# EAGLE design Robotics Ring Light (EAGLE 7.5.0)
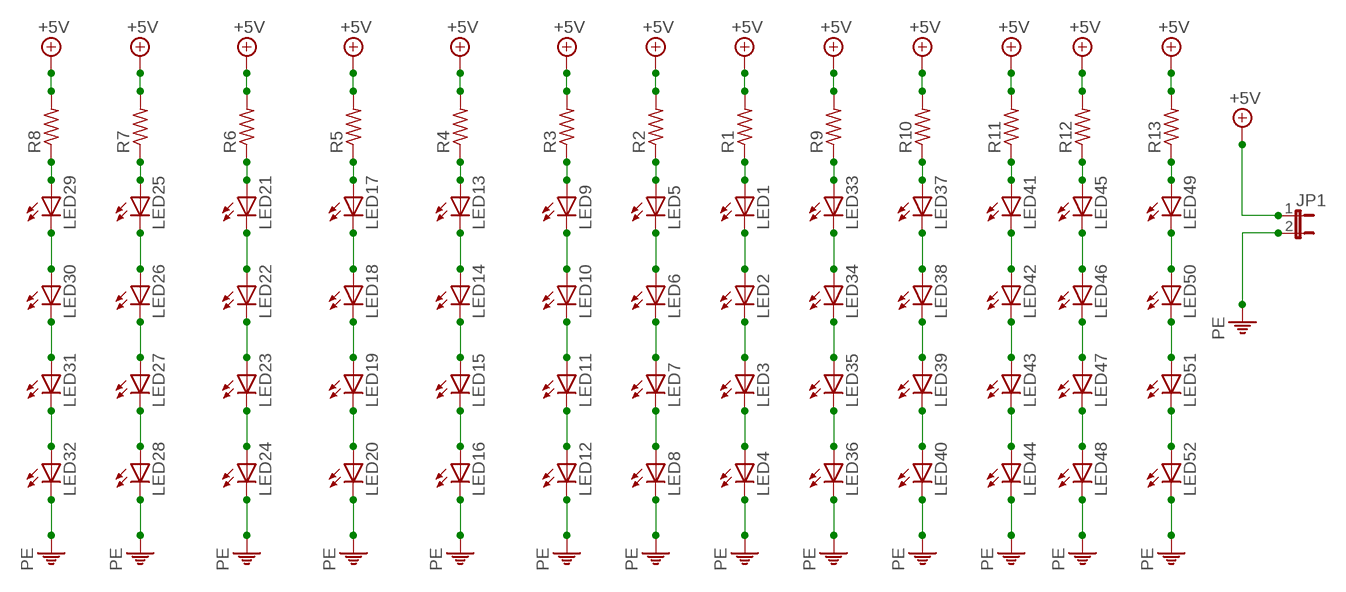
[diagram p0: schematic, sheet 1]

## Parts
JP1  JP1E  [JP1]
LED1  LED5MM  [LED5MM]
LED2  LED5MM  [LED5MM]
LED3  LED5MM  [LED5MM]
LED4  LED5MM  [LED5MM]
LED5  LED5MM  [LED5MM]
LED6  LED5MM  [LED5MM]
LED7  LED5MM  [LED5MM]
LED8  LED5MM  [LED5MM]
LED9  LED5MM  [LED5MM]
LED10  LED5MM  [LED5MM]
LED11  LED5MM  [LED5MM]
LED12  LED5MM  [LED5MM]
LED13  LED5MM  [LED5MM]
LED14  LED5MM  [LED5MM]
LED15  LED5MM  [LED5MM]
LED16  LED5MM  [LED5MM]
LED17  LED5MM  [LED5MM]
LED18  LED5MM  [LED5MM]
LED19  LED5MM  [LED5MM]
LED20  LED5MM  [LED5MM]
LED21  LED5MM  [LED5MM]
LED22  LED5MM  [LED5MM]
LED23  LED5MM  [LED5MM]
LED24  LED5MM  [LED5MM]
LED25  LED5MM  [LED5MM]
LED26  LED5MM  [LED5MM]
LED27  LED5MM  [LED5MM]
LED28  LED5MM  [LED5MM]
LED29  LED5MM  [LED5MM]
LED30  LED5MM  [LED5MM]
LED31  LED5MM  [LED5MM]
LED32  LED5MM  [LED5MM]
LED33  LED5MM  [LED5MM]
LED34  LED5MM  [LED5MM]
LED35  LED5MM  [LED5MM]
LED36  LED5MM  [LED5MM]
LED37  LED5MM  [LED5MM]
LED38  LED5MM  [LED5MM]
LED39  LED5MM  [LED5MM]
LED40  LED5MM  [LED5MM]
LED41  LED5MM  [LED5MM]
LED42  LED5MM  [LED5MM]
LED43  LED5MM  [LED5MM]
LED44  LED5MM  [LED5MM]
LED45  LED5MM  [LED5MM]
LED46  LED5MM  [LED5MM]
LED47  LED5MM  [LED5MM]
LED48  LED5MM  [LED5MM]
LED49  LED5MM  [LED5MM]
LED50  LED5MM  [LED5MM]
LED51  LED5MM  [LED5MM]
LED52  LED5MM  [LED5MM]
R1  R-US_0207/10  [0207/10]
R2  R-US_0207/10  [0207/10]
R3  R-US_0207/10  [0207/10]
R4  R-US_0207/10  [0207/10]
R5  R-US_0207/10  [0207/10]
R6  R-US_0207/10  [0207/10]
R7  R-US_0207/10  [0207/10]
R8  R-US_0207/10  [0207/10]
R9  R-US_0207/10  [0207/10]
R10  R-US_0207/10  [0207/10]
R11  R-US_0207/10  [0207/10]
R12  R-US_0207/10  [0207/10]
R13  R-US_0207/10  [0207/10]

## Nets
+5V: JP1.1 R1.2 R2.2 R3.2 R4.2 R5.2 R6.2 R7.2 R8.2 R9.2 R10.2 R11.2 R12.2 R13.2
N$1: LED1.K(C) LED2.A
N$2: LED2.K(C) LED3.A
N$3: LED3.K(C) LED4.A
N$4: LED5.K(C) LED6.A
N$5: LED1.A R1.1
N$6: LED6.K(C) LED7.A
N$7: LED7.K(C) LED8.A
N$8: LED5.A R2.1
N$9: LED9.K(C) LED10.A
N$10: LED10.K(C) LED11.A
N$11: LED11.K(C) LED12.A
N$12: LED9.A R3.1
N$13: LED13.K(C) LED14.A
N$14: LED14.K(C) LED15.A
N$15: LED15.K(C) LED16.A
N$16: LED13.A R4.1
N$17: LED17.K(C) LED18.A
N$18: LED18.K(C) LED19.A
N$19: LED19.K(C) LED20.A
N$20: LED17.A R5.1
N$21: LED21.K(C) LED22.A
N$22: LED22.K(C) LED23.A
N$23: LED23.K(C) LED24.A
N$24: LED21.A R6.1
N$25: LED25.K(C) LED26.A
N$26: LED26.K(C) LED27.A
N$27: LED27.K(C) LED28.A
N$28: LED25.A R7.1
N$29: LED29.K(C) LED30.A
N$30: LED30.K(C) LED31.A
N$31: LED31.K(C) LED32.A
N$32: LED29.A R8.1
N$33: LED33.K(C) LED34.A
N$34: LED34.K(C) LED35.A
N$35: LED35.K(C) LED36.A
N$36: LED33.A R9.1
N$37: LED37.K(C) LED38.A
N$38: LED38.K(C) LED39.A
N$39: LED39.K(C) LED40.A
N$40: LED37.A R10.1
N$41: LED41.K(C) LED42.A
N$42: LED42.K(C) LED43.A
N$43: LED43.K(C) LED44.A
N$44: LED41.A R11.1
N$45: LED45.K(C) LED46.A
N$46: LED46.K(C) LED47.A
N$47: LED47.K(C) LED48.A
N$48: LED45.A R12.1
N$49: LED49.K(C) LED50.A
N$50: LED50.K(C) LED51.A
N$51: LED51.K(C) LED52.A
N$52: LED49.A R13.1
PE: JP1.2 LED4.K(C) LED8.K(C) LED12.K(C) LED16.K(C) LED20.K(C) LED24.K(C) LED28.K(C) LED32.K(C) LED36.K(C) LED40.K(C) LED44.K(C) LED48.K(C) LED52.K(C)

## Library data of the parts
JP1 = jumper:JP1E: JUMPER
LED1-LED52 = led:LED: LED OSRAM: - CHIPLED LG R971, LG N971, LY N971, LG Q971, LY Q971, LO R971, LY R971 LH N974, LH R974 LS Q976, LO Q976, LY Q976 LO Q996 - Hyper CHIPLED LW Q18S LB Q993, LB Q99A, LB R99A - SideLED LS A670, LO A670, LY A670, LG A670, LP A670 LB A673, LV A673, LT A673, LW A673 LH A674 LY A675 LS A676, LA A676, LO A676, LY A676, LW A676 LS A679, LY A679, LG A679 - Hyper Micro SIDELED® LS Y876, LA Y876, LO Y876, LY Y876 LT Y87S - SmartLED LW L88C, LW L88S LB L89C, LB L89S, LG L890 LS L89K, LO L89K, LY L89K LS L896, LA L896, LO L896, LY L896 - TOPLED LS T670, LO T670, LY T670, LG T670, LP T670 LSG T670, LSP T670, LSY T670, LOP T670, LYG T670 LG T671, LOG T671, LSG T671 LB T673, LV T673, LT T673, LW T673 LH T674 LS T676, LA T676, LO T676, LY T676, LB T676, LH T676, LSB T676, LW T676 LB T67C, LV T67C, LT T67C, LS T67K, LO T67K, LY T67K, LW E67C LS E67B, LA E67B, LO E67B, LY E67B, LB E67C, LV E67C, LT E67C LW T67C LS T679, LY T679, LG T679 LS T770, LO T770, LY T770, LG T770, LP T770 LB T773, LV T773, LT T773, LW T773 LH T774 LS E675, LA E675, LY E675, LS T675 LS T776, LA T776, LO T776, LY T776, LB T776 LHGB T686 LT T68C, LB T68C - Hyper Mini TOPLED® LB M676 - Mini TOPLED Santana® LG M470 LS M47K, LO M47K, LY M47K Source: http://www.osram.convergy.de LUXEON: - LUMILED® LXK2-PW12-R00, LXK2-PW12-S00, LXK2-PW14-U00, LXK2-PW14-V00 LXK2-PM12-R00, LXK2-PM12-S00, LXK2-PM14-U00 LXK2-PE12-Q00, LXK2-PE12-R00, LXK2-PE12-S00, LXK2-PE14-T00, LXK2-PE14-U00 LXK2-PB12-K00, LXK2-PB12-L00, LXK2-PB12-M00, LXK2-PB14-N00, LXK2-PB14-P00, LXK2-PB14-Q00 LXK2-PR12-L00, LXK2-PR12-M00, LXK2-PR14-Q00, LXK2-PR14-R00 LXK2-PD12-Q00, LXK2-PD12-R00, LXK2-PD12-S00 LXK2-PH12-R00, LXK2-PH12-S00 LXK2-PL12-P00, LXK2-PL12-Q00, LXK2-PL12-R00 Source: www.luxeon.com KINGBRIGHT: KA-3528ASYC Source: www.kingbright.com
R1-R13 = resistor:R-US_: RESISTOR, American symbol

## Board
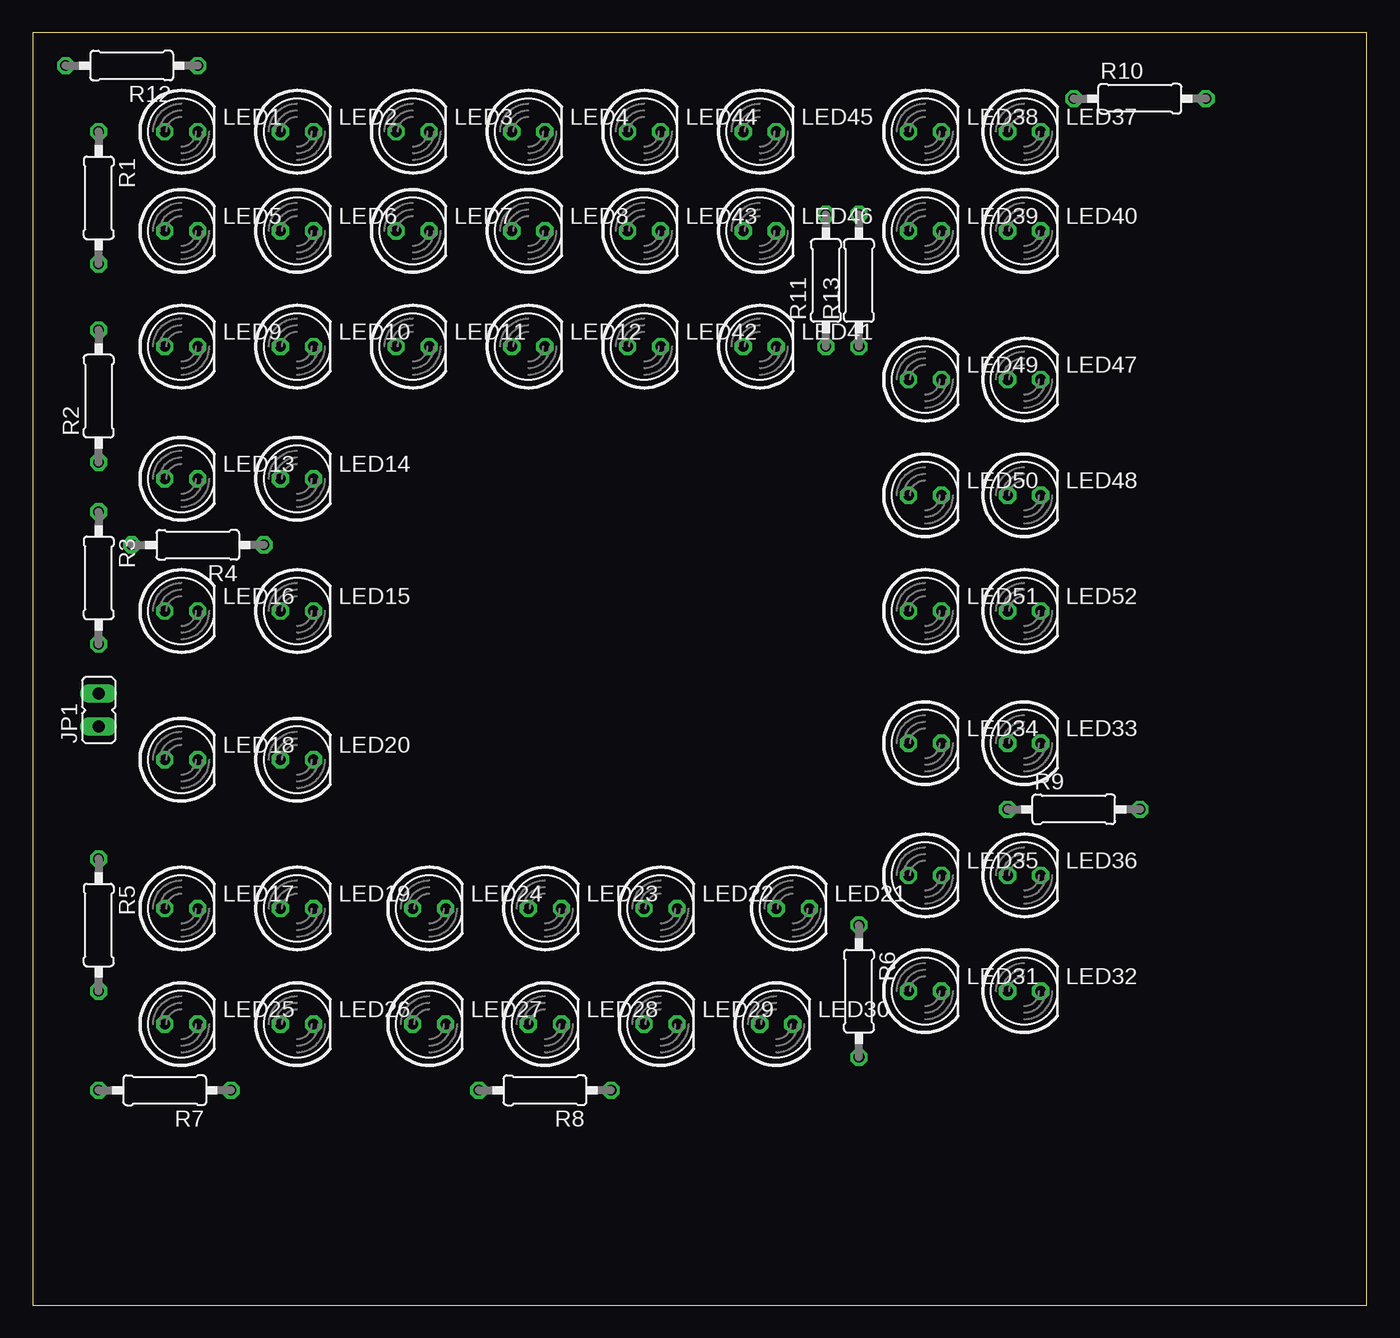
[diagram p1: board, top side]
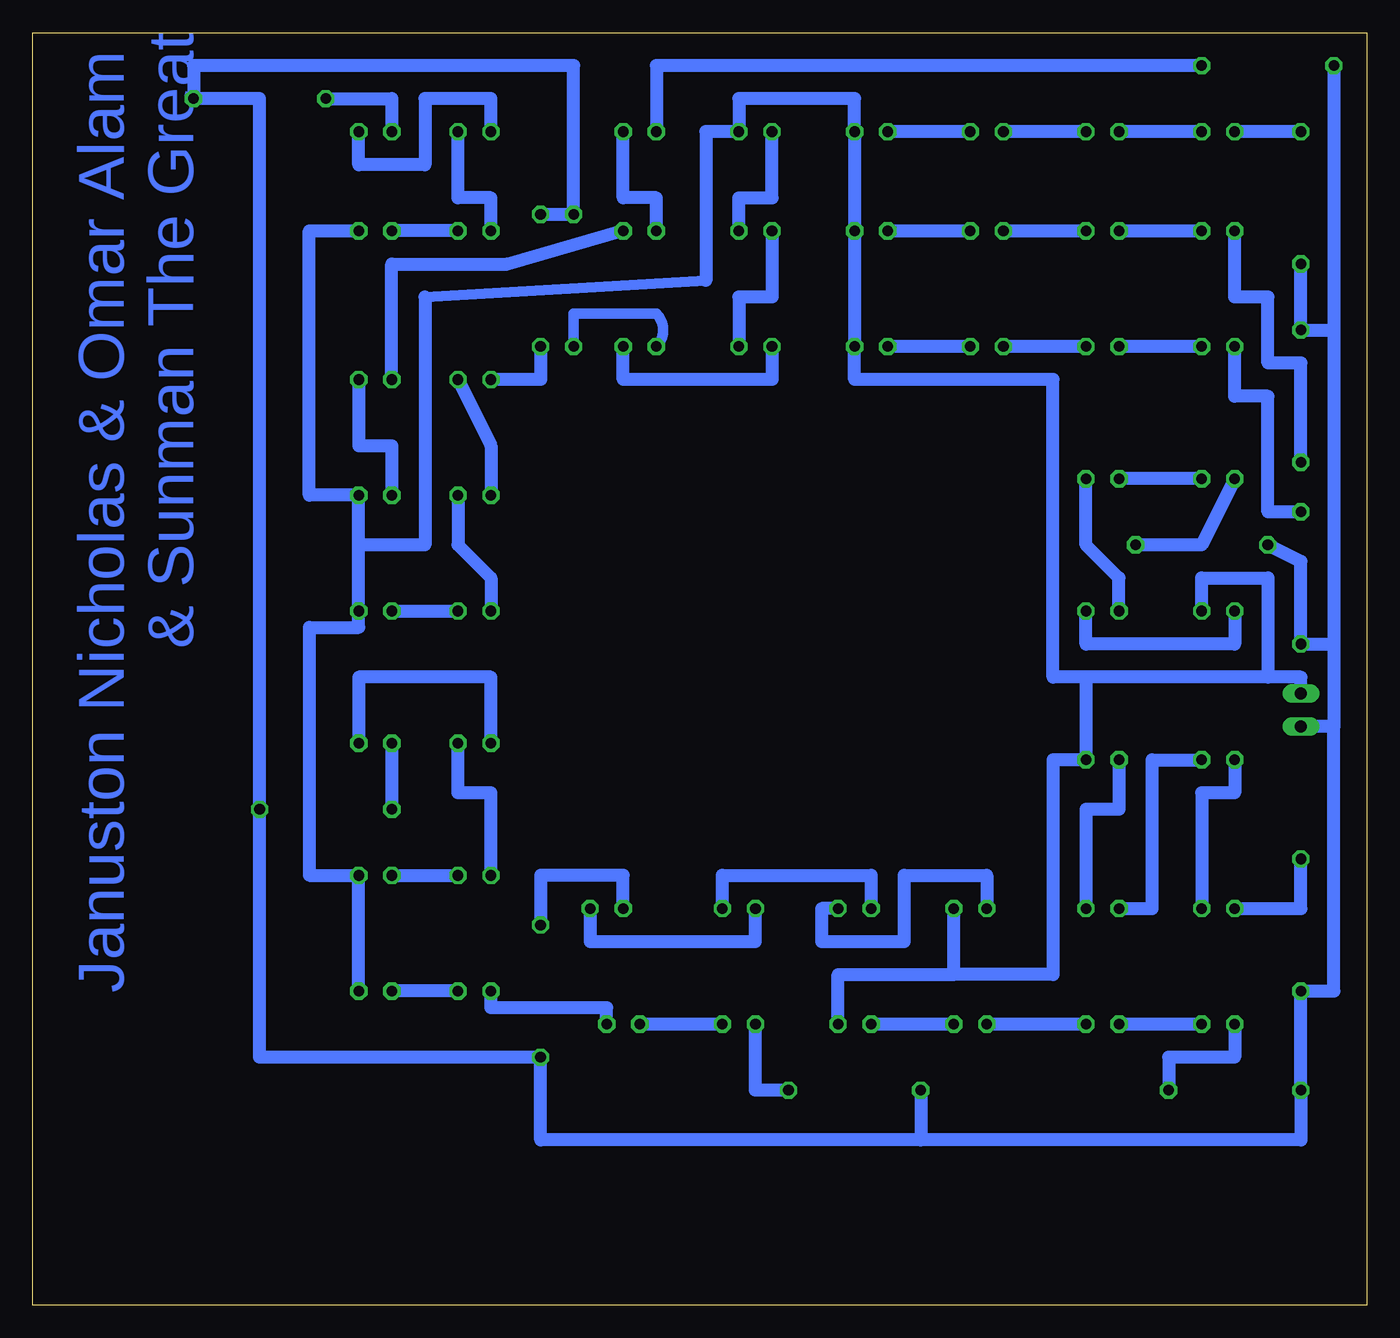
[diagram p2: board, bottom side, seen from below]

Size 102.54 x 97.78 mm. Coordinates in mm from the lower left corner, seen from the top.
Outline: 0,0 102.54,0 102.54,97.78 0,97.78 0,0
Copper layers (1*16): Top 0.035mm / dielectric 1.5mm / Bottom 0.035mm
Design rules "default": minimum track width 10mil, minimum drill 24mil, track to track 8mil, track to pad 8mil, pad to pad 8mil, via to via 8mil, smd to smd 8mil, copper to edge 40mil, drill to drill 8mil, minimum pad ring 10mil, minimum via ring 8mil, stop-mask expansion 4mil, vias tented up to drill 0mil, thermal gap 10mil

### Footprints (pad centres in the part's own frame; a part is rotated, then mirrored left to right if it is on the bottom)
JP1 = drill 0.914 long: 1 0,-1.27; 2 0,1.27
LED5MM = drill 0.813 octagon: A -1.27,0; K 1.27,0
0207/10 = drill 0.813 octagon: 1 -5.08,0; 2 5.08,0

### Placement (x,y rotation side)
JP1  5.08,45.72 0 top
LED1  11.43,90.17 0 top
LED2  20.32,90.17 0 top
LED3  29.21,90.17 0 top
LED4  38.1,90.17 0 top
LED5  11.43,82.55 0 top
LED6  20.32,82.55 0 top
LED7  29.21,82.55 0 top
LED8  38.1,82.55 0 top
LED9  11.43,73.66 0 top
LED10  20.32,73.66 0 top
LED11  29.21,73.66 0 top
LED12  38.1,73.66 0 top
LED13  11.43,63.5 0 top
LED14  20.32,63.5 0 top
LED15  20.32,53.34 0 top
LED16  11.43,53.34 0 top
LED17  11.43,30.48 0 top
LED18  11.43,41.91 0 top
LED19  20.32,30.48 0 top
LED20  20.32,41.91 0 top
LED21  58.42,30.48 0 top
LED22  48.26,30.48 0 top
LED23  39.37,30.48 0 top
LED24  30.48,30.48 0 top
LED25  11.43,21.59 0 top
LED26  20.32,21.59 0 top
LED27  30.48,21.59 0 top
LED28  39.37,21.59 0 top
LED29  48.26,21.59 0 top
LED30  57.15,21.59 0 top
LED31  68.58,24.13 0 top
LED32  76.2,24.13 0 top
LED33  76.2,43.18 0 top
LED34  68.58,43.18 0 top
LED35  68.58,33.02 0 top
LED36  76.2,33.02 0 top
LED37  76.2,90.17 0 top
LED38  68.58,90.17 0 top
LED39  68.58,82.55 0 top
LED40  76.2,82.55 0 top
LED41  55.88,73.66 0 top
LED42  46.99,73.66 0 top
LED43  46.99,82.55 0 top
LED44  46.99,90.17 0 top
LED45  55.88,90.17 0 top
LED46  55.88,82.55 0 top
LED47  76.2,71.12 0 top
LED48  76.2,62.23 0 top
LED49  68.58,71.12 0 top
LED50  68.58,62.23 0 top
LED51  68.58,53.34 0 top
LED52  76.2,53.34 0 top
R1  5.08,85.09 270 top
R2  5.08,69.85 90 top
R3  5.08,55.88 270 top
R4  12.7,58.42 180 top
R5  5.08,29.21 270 top
R6  63.5,24.13 270 top
R7  10.16,16.51 180 top
R8  39.37,16.51 180 top
R9  80.01,38.1 0 top
R10  85.09,92.71 0 top
R11  60.96,78.74 90 top
R12  7.62,95.25 180 top
R13  63.5,78.74 90 top

### Tracks (layer width: path | path; a pad name or v marks a point on that pad's centre or on a via)
+5V
  Bottom 1.016: 2.54,44.45 2.54,24.13 R5.2 R7.2 5.08,12.7 34.29,12.7 | 2.54,44.45 JP1.1 | 2.54,74.93 R2.2 R1.2 | 2.54,74.93 2.54,50.8 | 2.54,50.8 R3.2 5.08,57.15 R4.2 | 2.54,50.8 2.54,44.45 | 34.29,12.7 63.5,12.7 R6.2 85.09,19.05 R9.2 85.09,92.71 R10.2 90.17,95.25 60.96,95.25 R11.2 R13.2 | R8.2 34.29,12.7 | R12.2 2.54,74.93
N$1
  Bottom 1.016: LED1.K LED2.A
N$2
  Bottom 1.016: LED2.K LED3.A
N$3
  Bottom 1.016: LED3.K LED4.A
N$4
  Bottom 1.016: LED6.A LED5.K
N$5
  Bottom 1.016: R1.1 LED1.A
N$6
  Bottom 1.016: LED7.A LED6.K
N$7
  Bottom 1.016: LED8.A LED7.K
N$8
  Bottom 1.016: R2.1 5.08,72.39 7.62,72.39 7.62,77.47 10.16,77.47 LED5.A
N$9
  Bottom 1.016: LED9.K LED10.A
N$10
  Bottom 1.016: LED10.K LED11.A
N$11
  Bottom 1.016: LED11.K LED12.A
N$12
  Bottom 1.016: R3.1 7.62,60.96 7.62,69.85 10.16,69.85 LED9.A
N$13
  Bottom 1.016: LED13.K LED14.A
N$14
  Bottom 1.016: LED15.A 19.05,55.88 21.59,58.42 LED14.K
N$15
  Bottom 1.016: LED16.A 10.16,50.8 21.59,50.8 LED15.K
N$16
  Bottom 1.016: LED13.A 12.7,58.42 R4.1
N$17
  Bottom 1.016: LED18.A 10.16,39.37 12.7,39.37 LED17.K
N$18
  Bottom 1.016: LED19.A 16.51,30.48 16.51,41.91 LED18.K
N$19
  Bottom 1.016: LED20.A 19.05,38.1 21.59,38.1 LED19.K
N$20
  Bottom 1.016: LED17.A 5.08,30.48 R5.1
N$21
  Bottom 1.016: LED21.K 59.69,27.94 46.99,27.94 LED22.A
N$22
  Bottom 1.016: LED22.K 49.53,33.02 38.1,33.02 LED23.A
N$23
  Bottom 1.016: LED23.K 41.91,30.48 41.91,27.94 35.56,27.94 35.56,33.02 29.21,33.02 LED24.A
N$24
  Bottom 1.016: LED21.A 57.15,33.02 63.5,33.02 R6.1
N$25
  Bottom 1.016: LED25.K LED26.A
N$26
  Bottom 1.016: LED26.K LED27.A
N$27
  Bottom 1.016: LED27.K LED28.A
N$28
  Bottom 1.016: LED25.A 10.16,19.05 15.24,19.05 R7.1
N$29
  Bottom 1.016: LED29.K LED30.A
N$30
  Bottom 1.016: LED30.K 58.42,22.86 67.31,22.86 LED31.A
N$31
  Bottom 1.016: LED31.K LED32.A
N$32
  Bottom 1.016: R8.1 46.99,16.51 LED29.A
N$33
  Bottom 1.016: 67.31,46.99 LED34.A 67.31,48.26 77.47,48.26 LED33.K
N$34
  Bottom 1.016: LED35.A 67.31,39.37 69.85,39.37 LED34.K
N$35
  Bottom 1.016: LED36.A LED35.K
N$36
  Bottom 1.016: LED33.A R9.1
N$37
  Bottom 1.016: LED37.K 77.47,87.63 72.39,87.63 72.39,92.71 67.31,92.71 LED38.A
N$38
  Bottom 1.016: LED39.A 67.31,85.09 69.85,85.09 LED38.K
N$39
  Bottom 1.016: LED39.K LED40.A
N$40
  Bottom 1.016: R10.1 74.93,92.71 LED37.A
N$41
  Bottom 1.016: LED42.A 45.72,71.12 57.15,71.12 LED41.K
N$42
  Bottom 1.016: LED43.A 45.72,77.47 48.26,77.47 LED42.K
N$43
  Bottom 1.016: LED43.K 48.26,85.09 45.72,85.09 LED44.A
N$44
  Bottom 0.813: LED41.A arc-90 54.61,76.2 60.96,76.2 R11.1
N$45
  Bottom 1.016: LED46.A 54.61,85.09 57.15,85.09 LED45.K
N$46
  Bottom 1.016: LED46.K 66.04,80.01 74.93,80.01 LED47.A
N$47
  Bottom 1.016: LED47.K 77.47,66.04 74.93,66.04 LED48.A
N$48
  Bottom 1.016: LED45.A 54.61,95.25 R12.1
N$49
  Bottom 1.016: LED49.K 67.31,66.04 LED50.A
N$50
  Bottom 1.016: LED50.K 69.85,58.42 67.31,55.88 LED51.A
N$51
  Bottom 1.016: LED52.A LED51.K
N$52
  Bottom 1.016: R13.1 63.5,71.12 LED49.A
PE
  Bottom 0.813: 50.8,78.74 72.39,77.47
  Bottom 1.016: LED28.K 40.64,25.4 31.75,25.4 | 31.75,25.4 LED24.K | LED32.K LED36.K 81.28,33.02 81.28,52.07 77.47,52.07 LED52.K 77.47,58.42 | 77.47,58.42 LED48.K 81.28,62.23 81.28,82.55 LED40.K | 50.8,78.74 50.8,90.17 LED44.K 48.26,92.71 39.37,92.71 LED4.K LED8.K LED12.K 39.37,71.12 24.13,71.12 24.13,48.26 21.59,48.26 | 72.39,77.47 72.39,58.42 77.47,58.42 | LED16.K 12.7,55.88 7.62,55.88 7.62,48.26 | 7.62,48.26 21.59,48.26 | 21.59,48.26 LED20.K 24.13,41.91 24.13,25.4 31.75,25.4 | JP1.2 5.08,48.26 7.62,48.26

### Text on the board
Bottom: Januston Nicholas & Omar Alam / & Sunman The Great